# EAGLE design 209_ktemp_107 (EAGLE 9.6.2)
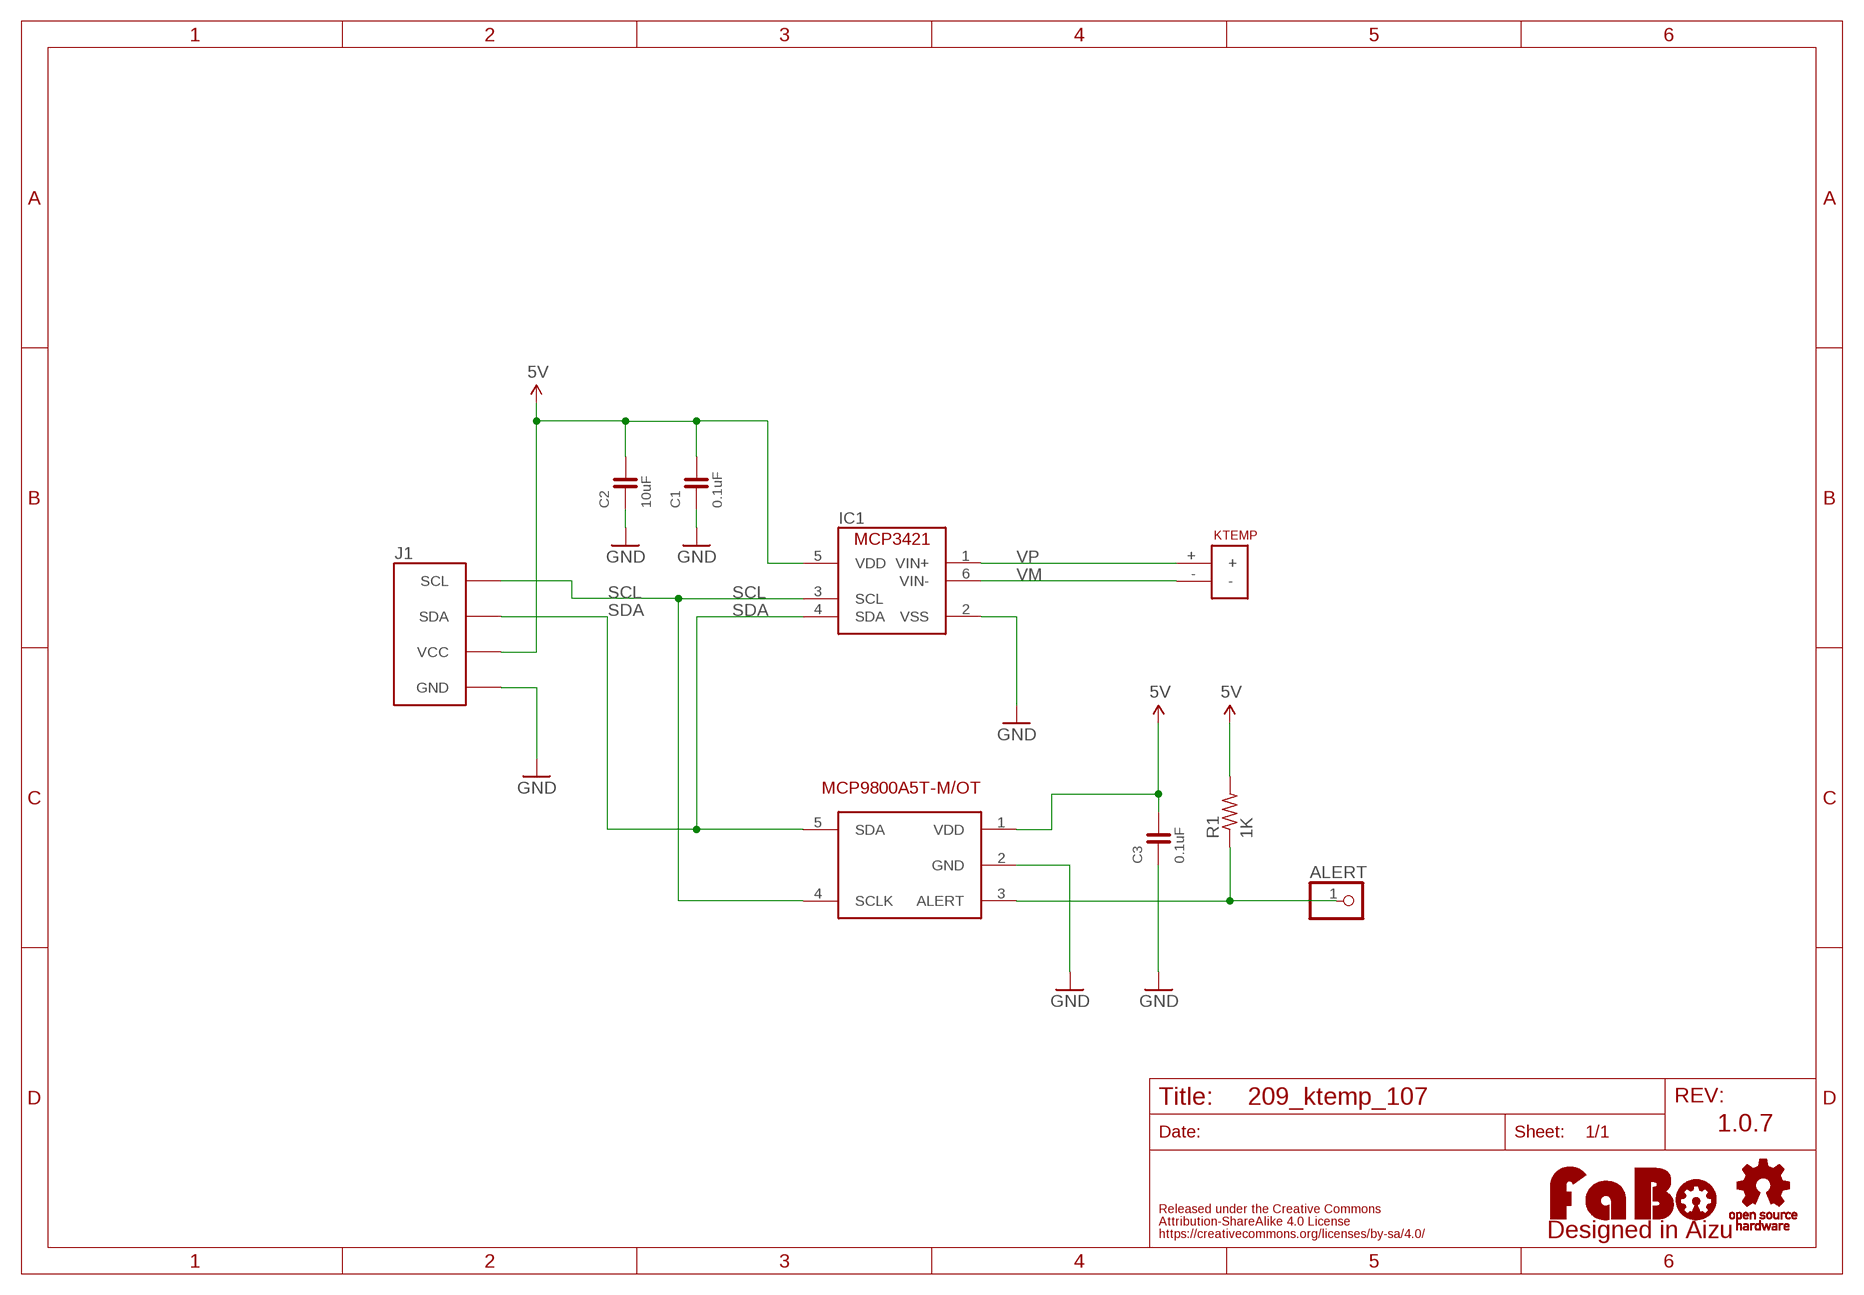
[diagram p0: schematic, sheet 1]

## Parts
ALERT  PINHD-1X1  [1X01]
C1  0.1uF  CAPACITOR-0603  [0603]
C2  10uF  CAPACITOR-0603  [0603]
C3  0.1uF  CAPACITOR-0603  [0603]
IC1  MCP3421  [SOT-23]
J1  FABO_BRICK_I2CI2C_TEMP_LOG2  [FABO_BRICK_I2C_LONG2]
LOGO1  LOGO_FABO-M  [LOGO_FABO_M]
R1  1K  R-US_R0603  [R0603]
U$2  PCC-SMP-J  [PCC-SMP-J]
U$3  LOGO_OSHW-M_BOTTOM  [LOGO_OSHW_M_BOTTOM]
U$5  MCP9800_SOT-23  [SOT23-5]

## Nets
5V: C1.2 C2.2 C3.2 IC1.5(VDD) J1.VCC R1.2 U$5.1(VDD)
GND: C1.1 C2.1 C3.1 IC1.2(VSS) J1.GND U$5.2(GND)
N$2: ALERT.1 R1.1 U$5.3(ALERT)
SCL: IC1.3(SCL) J1.SCL U$5.4(SCLK)
SDA: IC1.4(SDA) J1.SDA U$5.5(SDA)
VM: IC1.6(VIN-) U$2.-
VP: IC1.1(VIN+) U$2.+

## Notes on the sheet
- 1.0.7

## Library data of the parts
ALERT = pinhead:PINHD-1X1: PIN HEADER
C1-C3 = FaBo-Capacitor:CAPACITOR: CAPACITOR
IC1 = FaBo-Sensor:MCP3421
J1 = FaBo-Template:FABO_BRICK_I2C: FaBo Brick I2C
LOGO1 = component:LOGO_FABO
R1 = rcl:R-US_: RESISTOR, American symbol; SPICEPREFIX: R
U$2 = FaBo-Connetor:PCC-SMP-J
U$3 = FaBo-etc:LOGO_OSHW
U$5 = Fabo2:MCP9800_SOT-23

## Board
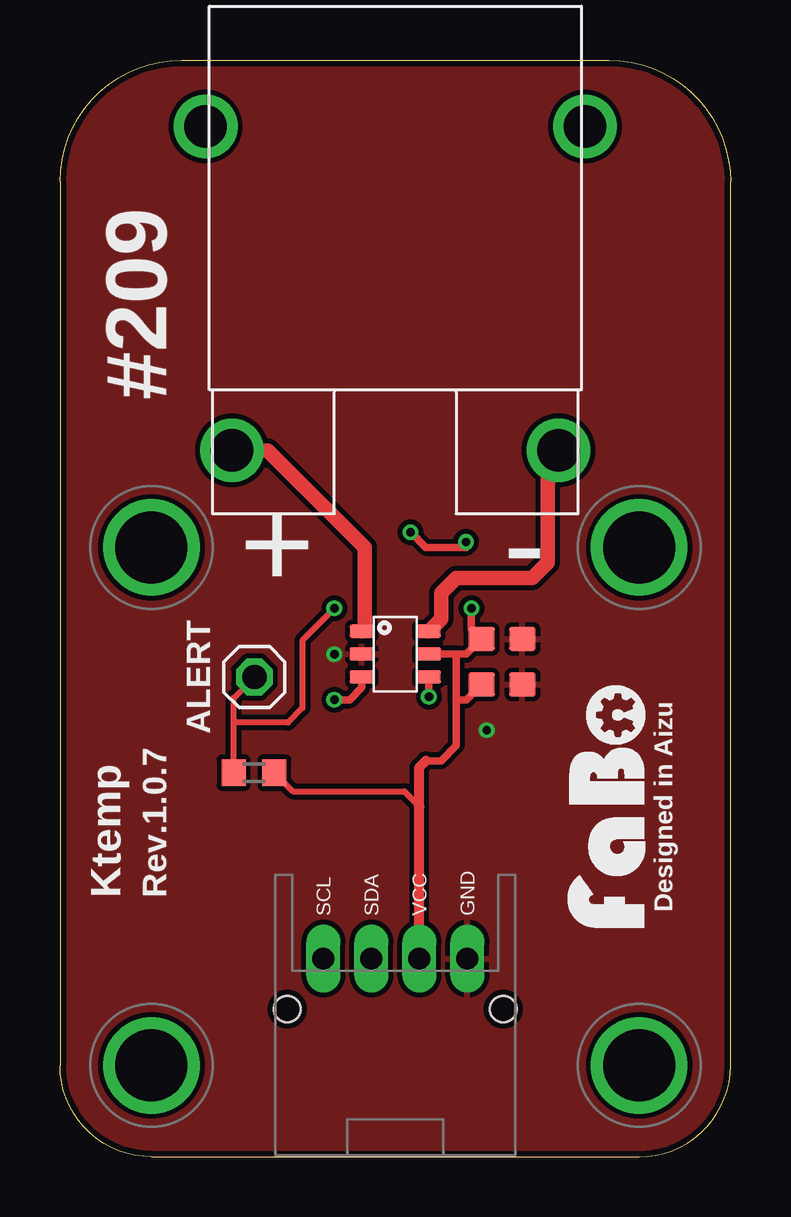
[diagram p1: board, top side]
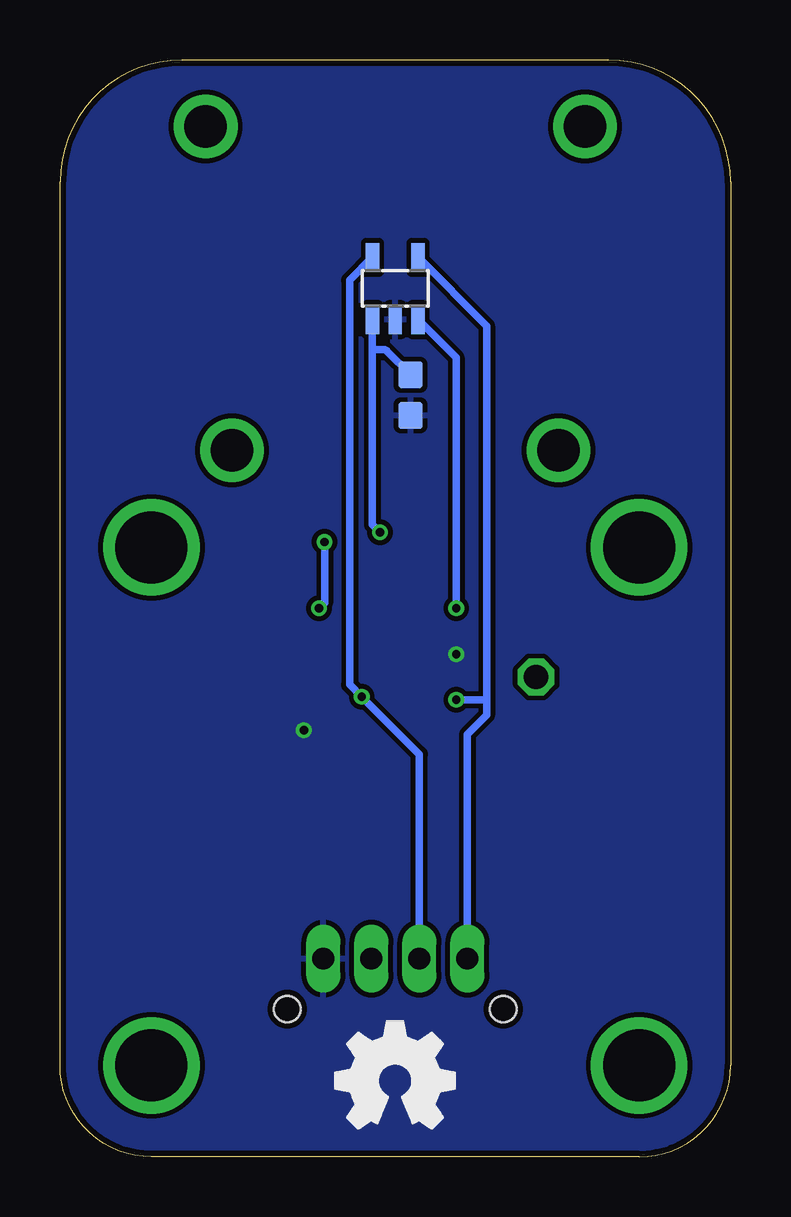
[diagram p2: board, bottom side, seen from below]

Size 27.94 x 45.72 mm. Coordinates in mm from the lower left corner, seen from the top.
Copper layers (1*16): Top 0.035mm / dielectric 1.6mm / Bottom 0.035mm
Design rules "PCBway": minimum track width 6mil, minimum drill 12mil, track to track 6mil, track to pad 6mil, pad to pad 6mil, via to via 6mil, smd to smd 6mil, copper to edge 10mil, drill to drill 10mil, minimum pad ring 10mil, minimum via ring 6mil, stop-mask expansion 2mil, vias tented up to drill 100mil, thermal gap 8mil

### Footprints (pad centres in the part's own frame; a part is rotated, then mirrored left to right if it is on the bottom)
1X01 = drill 1.016 octagon: 1 0,0
0603 = smd 1.1 x 1: 1 -0.85,0; 2 0.85,0
SOT-23 = smd 1 x 0.55: 1 -1.4,0.95; 2 -1.4,0; 3 -1.4,-0.95; 4 1.4,-0.95; 5 1.4,0; 6 1.4,0.95
FABO_BRICK_I2C_LONG2 = drill 0.9 pad 1.422 long: GND 3,-10.795; SCL -3,-10.795; SDA -1,-10.795; VCC 1,-10.795 | drill 3 pad 3.81: P$1 -10.16,6.35; P$2 10.16,6.35; P$3 -10.16,-15.24; P$4 10.16,-15.24 | hole 1.1: -4.5,-12.895; 4.5,-12.895
R0603 = smd 1 x 1.1: 1 -0.85,0; 2 0.85,0
PCC-SMP-J = drill 1.77: + -6.8,-6.75; - 6.8,-6.75; P$3 -7.9,6.75; P$4 7.9,6.75
SOT23-5 = smd 0.55 x 1.2: 1 -0.95,-1.3; 2 0,-1.3; 3 0.95,-1.3; 4 0.95,1.3; 5 -0.95,1.3

### Placement (x,y rotation side)
ALERT  8.1,20 0 top
C1  18.41,21.59 180 top
C2  18.41,19.68 180 top
C3  13.34,31.75 90 bottom
IC1  13.97,20.95 0 top
J1  13.97,19.05 0 top
LOGO1  24.77,14.61 90 top
R1  8.09,16.01 0 top
U$2  13.97,36.2 0 top
U$3  13.97,3.17 0 top
U$5  13.97,36.2 0 bottom

### Tracks (layer width: path | path; a pad name or v marks a point on that pad's centre or on a via)
5V  (via drill 0.35)
  Top 0.254: R1.2 9.71,15.24 14.34,15.24 14.97,14.61
  Top 0.305: 16.51,19.05 16.51,20.95 | 16.51,20.95 IC1.5 | 16.51,19.05 16.93,19.05 C2.2 | 16.51,20.95 16.93,20.95 C1.2 17.14,22.01 v17.14,22.86 | 16.51,19.05 16.51,17.14 15.88,16.51 15.24,16.51 | v14.61,26.04 15.24,25.4 16.94,25.4 17.04,25.5 v16.92,25.63
  Top 0.406: J1.VCC 14.97,14.61 14.97,16.24 15.24,16.51
  Bottom 0.305: U$5.1 14.92,33.66 | 14.92,33.66 14.92,26.35 v14.61,26.04 | v16.92,25.63 16.92,23.09 v17.14,22.86 | C3.2 14.32,33.58 arc-45 14.49,33.66 14.92,33.66
GND  (via drill 0.35)
  other vias: 11.43,20.95 17.78,17.78
  pour Bottom (isolate 0.203): 0,0 27.94,0 27.94,45.72 0,45.72
  pour Top (isolate 0.203): 0,0 27.94,0 27.94,45.72 0,45.72
N$2  (via drill 0.35)
  Top 0.254: R1.1 7.24,18.1 | v11.43,22.86 10.1,21.53 10.1,18.7 9.5,18.1 7.24,18.1 | 7.24,18.1 7.24,19.14 ALERT.1
  Bottom 0.305: U$5.3 11.43,33.3 v11.43,22.86
SCL  (via drill 0.35)
  Top 0.305: v11.43,19.05 12.06,19.05 12.57,19.55 IC1.3
  Bottom 0.305: U$5.4 10.16,34.63 10.16,19.05 | 10.16,19.05 v11.43,19.05 | 10.16,19.05 10.16,18.41 10.97,17.61 J1.SCL
SDA  (via drill 0.35)
  Top 0.305: IC1.4 v15.37,19.18
  Bottom 0.305: U$5.5 15.88,36.54 15.88,19.68 v15.37,19.18 12.97,16.78 J1.SDA
VM
  Top 0.61: IC1.6 15.88,22.41 15.88,23.5 16.51,24.13 19.68,24.13 20.32,24.77 20.32,29 U$2.-
VP
  Top 0.61: IC1.1 12.7,22.04 12.7,25.4 8.65,29.45 U$2.+

### Text on the board
tPlace: #209 | Designed in Aizu | Ktemp | Rev.1.0.7